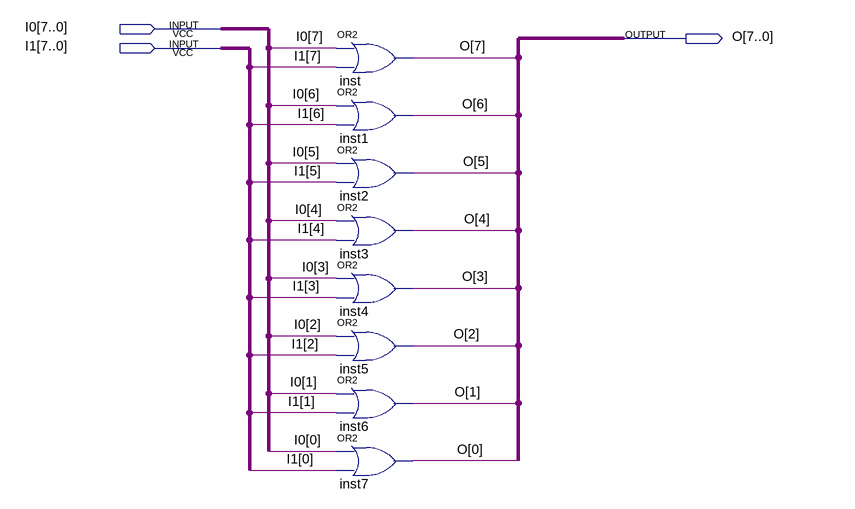
[diagram p0: schematic sheet]
// Quartus schematic OR2_8b.bdf as structural Verilog: 8 symbols, 3 pins
module OR2_8b (
  input  [7:0] I0,
  input  [7:0] I1,
  output [7:0] O
);

  or inst (O[7], I0[7], I1[7]);
  or inst1 (O[6], I0[6], I1[6]);
  or inst2 (O[5], I0[5], I1[5]);
  or inst3 (O[4], I0[4], I1[4]);
  or inst4 (O[3], I0[3], I1[3]);
  or inst5 (O[2], I0[2], I1[2]);
  or inst6 (O[1], I0[1], I1[1]);
  or inst7 (O[0], I0[0], I1[0]);
endmodule
